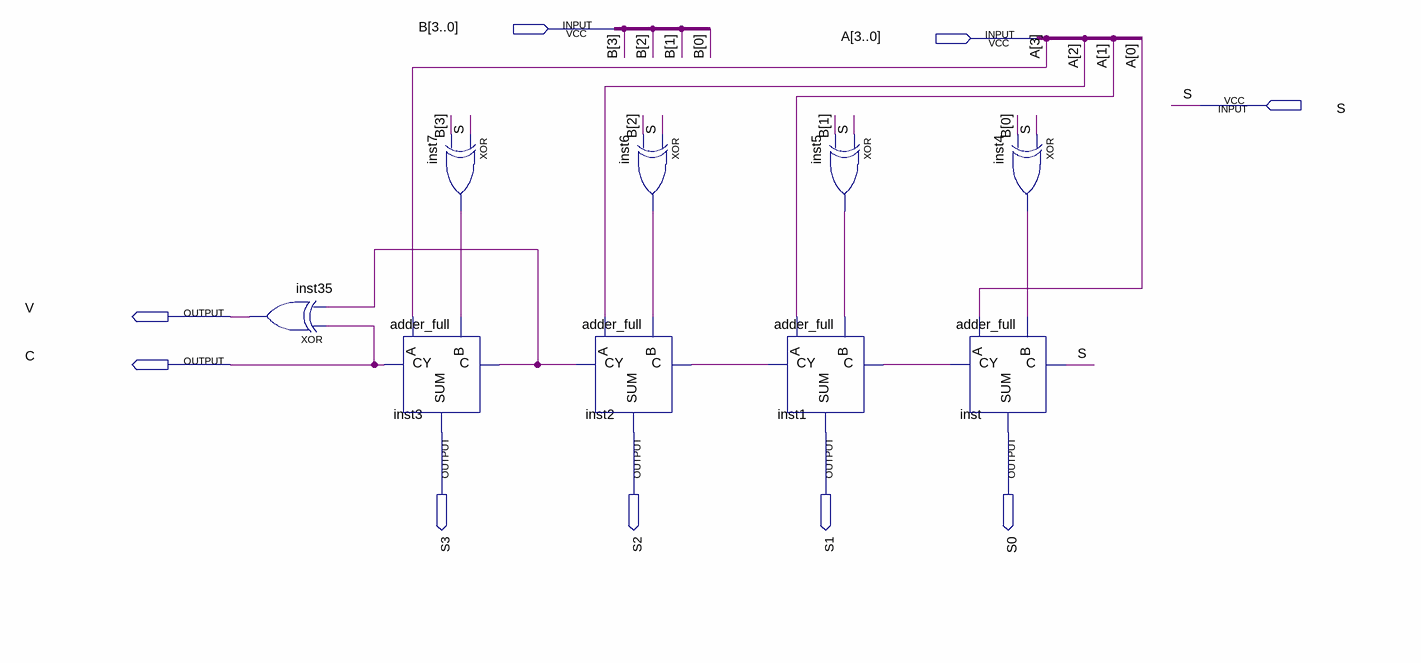
[diagram p0: schematic sheet]
// Quartus schematic HW1.bdf as structural Verilog: 9 symbols, 9 pins
module HW1 (
  input  [3:0] B,
  input  [3:0] A,
  input  S,
  output V,
  output C,
  output S3,
  output S2,
  output S1,
  output S0
);

  wire inst1_cy, inst2_cy, inst4_out, inst5_out, inst6_out, inst7_out, inst_cy;

  xor inst35 (V, C, inst2_cy);
  xor inst7 (inst7_out, S, B[3]);
  adder_full inst3 (.A(A[3]), .B(inst7_out), .C(inst2_cy), .CY(C), .SUM(S3));
  adder_full inst2 (.A(A[2]), .B(inst6_out), .C(inst1_cy), .CY(inst2_cy), .SUM(S2));
  xor inst6 (inst6_out, S, B[2]);
  xor inst5 (inst5_out, S, B[1]);
  adder_full inst1 (.A(A[1]), .B(inst5_out), .C(inst_cy), .CY(inst1_cy), .SUM(S1));
  adder_full inst (.A(A[0]), .B(inst4_out), .C(S), .CY(inst_cy), .SUM(S0));
  xor inst4 (inst4_out, S, B[0]);
endmodule
